# EAGLE design Opdracht3 (EAGLE 9.5.1)
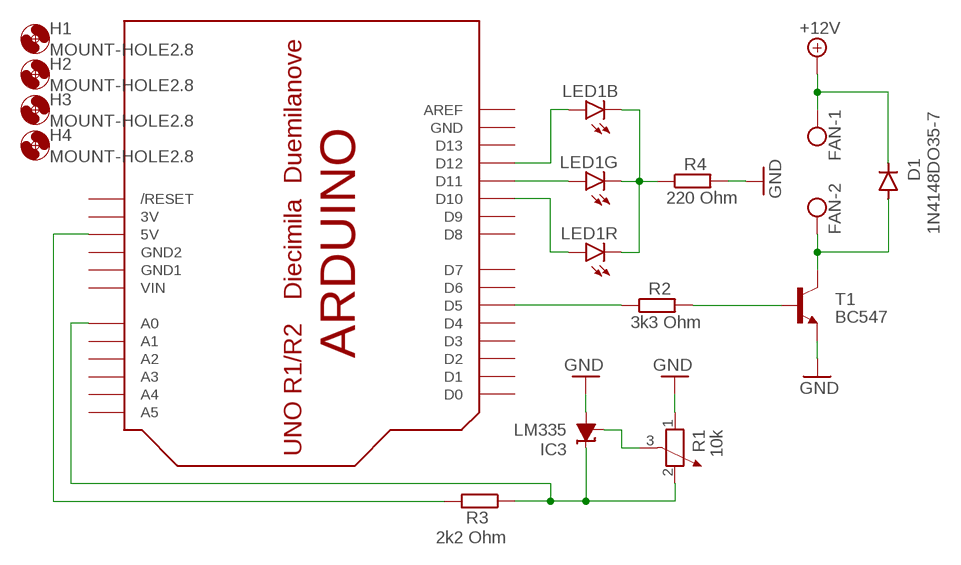
[diagram p0: schematic, sheet 1]

## Parts
D1  1N4148DO35-7  [DO35-7]
FAN  W237-102  [W237-102]
H1  MOUNT-HOLE2.8  [2,8]
H2  MOUNT-HOLE2.8  [2,8]
H3  MOUNT-HOLE2.8  [2,8]
H4  MOUNT-HOLE2.8  [2,8]
IC3  LM335  LM4041BILP  [LP_O-PBCY-W3]
LED1  GM5WA94310A  [GM5WA94310A]
R1  10k  POTENTIOMETER_PT-10  [PT-10]
R2  3k3 Ohm  R-EU_0207/10  [0207/10]
R3  2k2 Ohm  R-EU_0207/10  [0207/10]
R4  220 Ohm  R-EU_0207/10  [0207/10]
T1  BC547  [TO92]
U$1  ARDUINOUNO  [ARDUINO]

## Nets
+12V: D1.C FAN.1
GND: IC3.3(A) R1.1 R4.2 T1.1(E)
N$1: R3.2 U$1.5V
N$2: IC3.2(C) R1.2 R3.1 U$1.A0
N$3: LED1.2(R:A) U$1.D10
N$4: LED1.3(G:A) U$1.D11
N$5: LED1.1(B:A) U$1.D12
N$6: IC3.1(FB) R1.3
N$7: R2.1 U$1.D5
N$8: R2.2 T1.2(B)
N$9: D1.A FAN.2 T1.3(C)
N$11: LED1.4(G:C) LED1.5(R:C) LED1.6(B:C) R4.1
Unconnected: U$1.A1 U$1.A2 U$1.A3 U$1.A4 U$1.A5 U$1.AREF U$1.D0 U$1.D1 U$1.D2 U$1.D3 U$1.D4 U$1.D6 U$1.D7 U$1.D8 U$1.D9 U$1.D13 U$1.RESET(/RESET)

## Power pins joined to a net without a drawn wire
3V: U$1.3V
GND: U$1.GND
GND1: U$1.GND1
GND2: U$1.GND2
VIN: U$1.VIN

## Library data of the parts
D1 = diode:1N4148: DIODE high speed (Philips)
FAN = con-wago-500:W237-102: WAGO SCREW CLAMP; MPN: 237-102; OC_FARNELL: unknown; OC_NEWARK: 70K9898
H1-H4 = holes:MOUNT-HOLE: MOUNTING HOLE with drill center marker
IC3 = texas:LM4041*I: PRECISION MICROPOWER SHUNT VOLTAGE REFERENCE Adjustable Output Source: http://focus.ti.com/lit/ds/slcs146e/slcs146e.pdf; OC_FARNELL: unknown; OC_NEWARK: unknown
LED1 = led:GM5WA94310A: Chip LED RGB Source: http://document.sharpsma.com/files/GM5WA94310A_SS.pdf
R1 = rcl:POTENTIOMETER_: Potentiometer; SPICEMODEL: POT; SPICEPREFIX: X
R2-R4 = rcl:R-EU_: RESISTOR, European symbol; SPICEPREFIX: R
T1 = transistor:BC547: NPN TRANSISTOR
U$1 = adafruit:ARDUINO: Arduino Diecimila/Duemilanove Make a shield with ease, this package has all the named pins as well as the two mounting drill holes and an outline of the USB and DC power connector. The outline is on the DIMENSION layer, so if your board house uses it they will cut the outline to match. http://www.ladyada.net/library/pcb/eaglelibrary.html

## Board
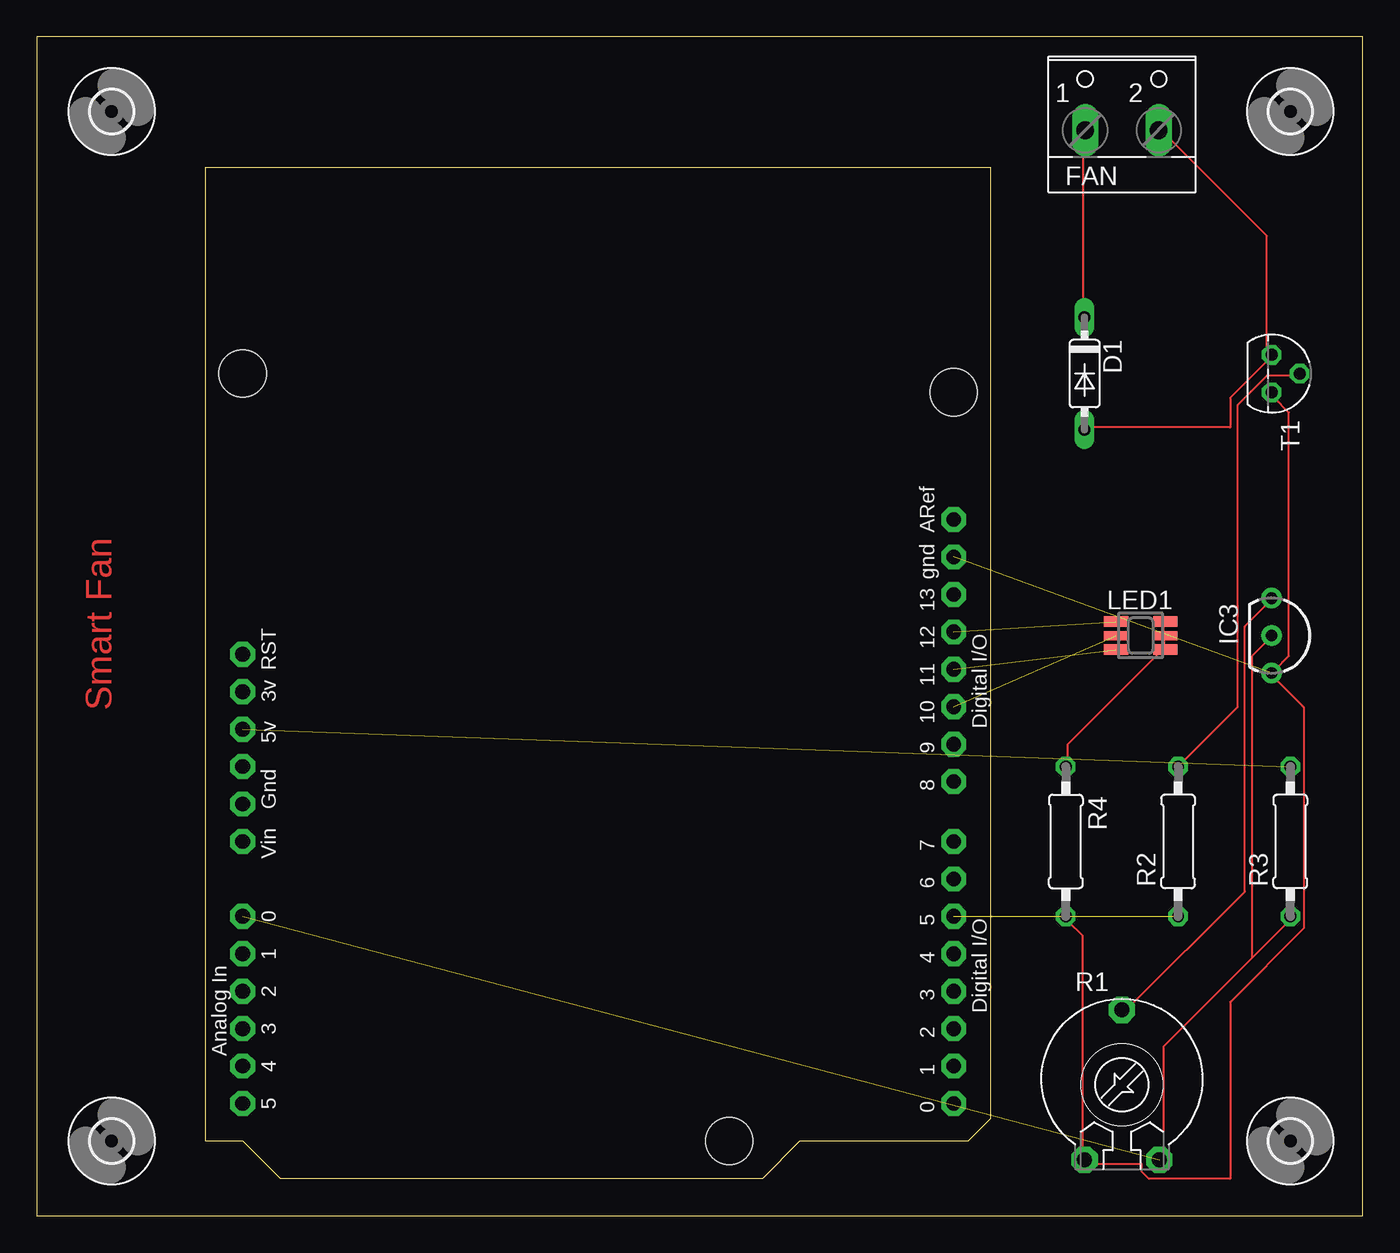
[diagram p1: board, top side]

Size 90 x 80 mm. Coordinates in mm from the lower left corner, seen from the top.
Outline: 0,0 90,0 90,80 0,80 0,0
Copper layers (1*16): Top 0.035mm / dielectric 1.5mm / Bottom 0.035mm
Design rules "default": minimum track width 6mil, minimum drill 0.35mm, track to track 6mil, track to pad 6mil, pad to pad 6mil, via to via 6mil, smd to smd 6mil, copper to edge 40mil, drill to drill 6mil, minimum pad ring 10mil, minimum via ring 8mil, stop-mask expansion 4mil, vias tented up to drill 0mil, thermal gap 10mil

### Footprints (pad centres in the part's own frame; a part is rotated, then mirrored left to right if it is on the bottom)
DO35-7 = drill 0.813 long: A 3.81,0; C -3.81,0
W237-102 = drill 1.194 long: 1 -2.5,-1.27; 2 2.5,-1.27
2,8 = hole 2.8: 0,0
LP_O-PBCY-W3 = drill 0.8 pad 1.4: 1 -2.54,0; 2 0,0; 3 2.54,0
GM5WA94310A = smd 0.7 x 1.65: 1 -0.95,-1.675; 3 0.95,-1.675; 4 0.95,1.675; 6 -0.95,1.675 | smd 0.6 x 1.65: 2 0,-1.675; 5 0,1.675
PT-10 = drill 1.016 pad 1.778 octagon: 1 -2.54,-5.08; 2 2.54,-5.08; 3 0,5.08
0207/10 = drill 0.813 octagon: 1 -5.08,0; 2 5.08,0
TO92 = drill 0.813 octagon: 1 1.27,0; 2 0,1.905; 3 -1.27,0
ARDUINO = drill 1 pad 1.676 octagon: 3V 35.56,2.54; 5V 38.1,2.54; A0 50.8,2.54; A1 53.34,2.54; A2 55.88,2.54; A3 58.42,2.54; A4 60.96,2.54; A5 63.5,2.54; AREF 23.876,50.8; D0 63.5,50.8; D1 60.96,50.8; D2 58.42,50.8; D3 55.88,50.8; D4 53.34,50.8; D5 50.8,50.8; D6 48.26,50.8; D7 45.72,50.8; D8 41.656,50.8; D9 39.116,50.8; D10 36.576,50.8; D11 34.036,50.8; D12 31.496,50.8; D13 28.956,50.8; GND 26.416,50.8; GND1 43.18,2.54; GND2 40.64,2.54; RESET 33.02,2.54; VIN 45.72,2.54 | hole 3.2: 15.24,50.8; 66.04,35.56; 13.97,2.54

### Placement (x,y rotation side)
D1  71.12,57.15 270 top
FAN  73.66,74.93 0 top
H1  5.08,5.08 0 top
H2  5.08,74.93 0 top
H3  85.09,5.08 0 top
H4  85.09,74.93 0 top
IC3  83.82,39.37 270 top
LED1  74.93,39.37 270 top
R1  73.66,8.89 0 top
R2  77.47,25.4 90 top
R3  85.09,25.4 90 top
R4  69.85,25.4 270 top
T1  83.82,57.15 270 top
U$1  11.43,71.12 270 top

### Tracks (layer width: path | path; a pad name or v marks a point on that pad's centre or on a via)
+12V
  Top 0.152: D1.C 71,61 71,73.5 FAN.1
GND  (1 unrouted)
  Top 0.152: R4.2 70,20 71,19 71,4 R1.1 71.5,3.5 75,3.5 75,3 75.5,2.5 81,2.5 81,14.5 86,19.5 86,34.5 84,36.5 IC3.3 84,37 85,38 85,54.5 84,55.5 T1.1
N$1  (1 unrouted)
N$2  (1 unrouted)
  Top 0.152: 82.5,17.5 76.5,11.5 76.5,4 R1.2 | 82.5,17.5 85,20 R3.1 | 82.5,17.5 82.5,38 83.5,39 IC3.2
N$3  (1 unrouted)
N$4  (1 unrouted)
N$5  (1 unrouted)
N$6
  Top 0.152: IC3.1 83.5,41.5 82,40 82,22 74,14 R1.3
N$7  (1 unrouted)
N$8
  Top 0.152: R2.2 77.5,30.5 81.5,34.5 81.5,55 83.5,57 85.5,57 T1.2
N$9
  Top 0.152: D1.A 71.5,53.5 81,53.5 81,55.5 83.5,58 T1.3 83.5,58.5 83.5,66.5 76.5,73.5 FAN.2
N$11
  Top 0.152: 76.5,39.5 76.5,38.5 | 76.5,39.5 76.5,40 LED1.6 | 76.5,39.5 LED1.5 | 76.5,38.5 70,32 70,30.5 R4.1 | 76.5,38.5 LED1.4

### Text on the board
Top: Smart Fan